# Altium schematic sheet Sh_VL53L7CXV0GC.SchDoc
size A4; SheetNumber: 1; SheetTotal: 1
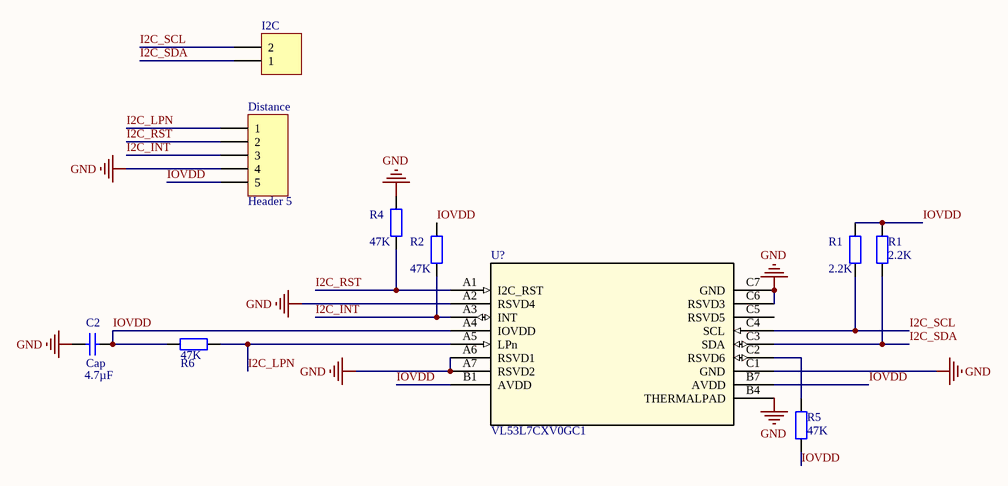
[diagram p0: Sh_VL53L7CXV0GC.SchDoc]

## Parts
(Parts that share a designator on the sheet are numbered #1, #2 ... from top to bottom, then left to right.)
C2  Cap  value 4.7µF  [Capacitor 1206]
Distance  Header 5  [B5BXHAMLFSN]
I2C  (no value)  [B2BXHAMLFSN]
R1#1  value 2.2K  [Resistor 1206]  (hidden comment: Res2)
R1#2  value 2.2K  [Resistor 1206]  (hidden comment: Res2)
R2  value 47K  [Resistor 1206]  (hidden comment: Res2)
R4  value 47K  [Resistor 1206]  (hidden comment: Res2)
R5  value 47K  [Resistor 1206]  (hidden comment: Res2)
R6  value 47K  [Resistor 1206]  (hidden comment: Res2)
U?  VL53L7CXV0GC1  [LGA16_OPTICAL-LINER_STM]

## Nets
GND: C2.2 Distance.4 R4.2 U?.A2(RSVD4) U?.A6(RSVD1) U?.A7(RSVD2) U?.B4(THERMALPAD) U?.C1(GND) U?.C6(RSVD3) U?.C7(GND)
I2C_INT: Distance.3 R2.1 U?.A3(INT)
I2C_LPN: Distance.1 R6.2 U?.A5(LPn)
I2C_RST: Distance.2 R4.1 U?.A1(I2C_RST)
I2C_SCL: I2C.2 R1#2.1 U?.C4(SCL)
I2C_SDA: I2C.1 R1#1.2 U?.C3(SDA)
IOVDD: C2.1 Distance.5 R1#1.1 R1#2.2 R2.2 R5.2 R6.1 U?.A4(IOVDD) U?.B1(AVDD) U?.B7(AVDD)
NetR5_1: R5.1 U?.C2(RSVD6)

Not connected (* = marked no-connect by the designer): U? C5(RSVD5)

## Library data of the parts
C2 = Cap: Capacitor; Published: 8-Jun-2000; LatestRevisionDate: 17-Jul-2002; LatestRevisionNote: Re-released for DXP Platform.; PackageReference: RAD-0.3; Publisher: Altium Limited; PackageDescription: Radial Cap, Thru-Hole; 2 Leads; 0.3 in Pin Spacing
Distance = Header 5: Header, 5-Pin; LatestRevisionDate: 17-Jul-2002; LatestRevisionNote: Re-released for DXP Platform.; Publisher: Altium Limited
I2C = Header 2H: Header, 2-Pin, Right Angle; LatestRevisionDate: 17-Jul-2002; LatestRevisionNote: Re-released for DXP Platform.; Publisher: Altium Limited
R1#1 R1#2 R2 R4-R6 = Res2: Resistor; Published: 8-Jun-2000; LatestRevisionDate: 17-Jul-2002; LatestRevisionNote: Re-released for DXP Platform.; PackageReference: AXIAL-0.4; Publisher: Altium Limited; PackageDescription: Axial Device, Thru-Hole; 2 Leads; 0.4 in Pin Spacing
U? = VL53L7CXV0GC1: No Description Available; Mfr_Name: STMicroelectronics; RefDes: RefDes; Type: Type